# EAGLE design RFSWITCH_v2 (EAGLE 7.1.0)
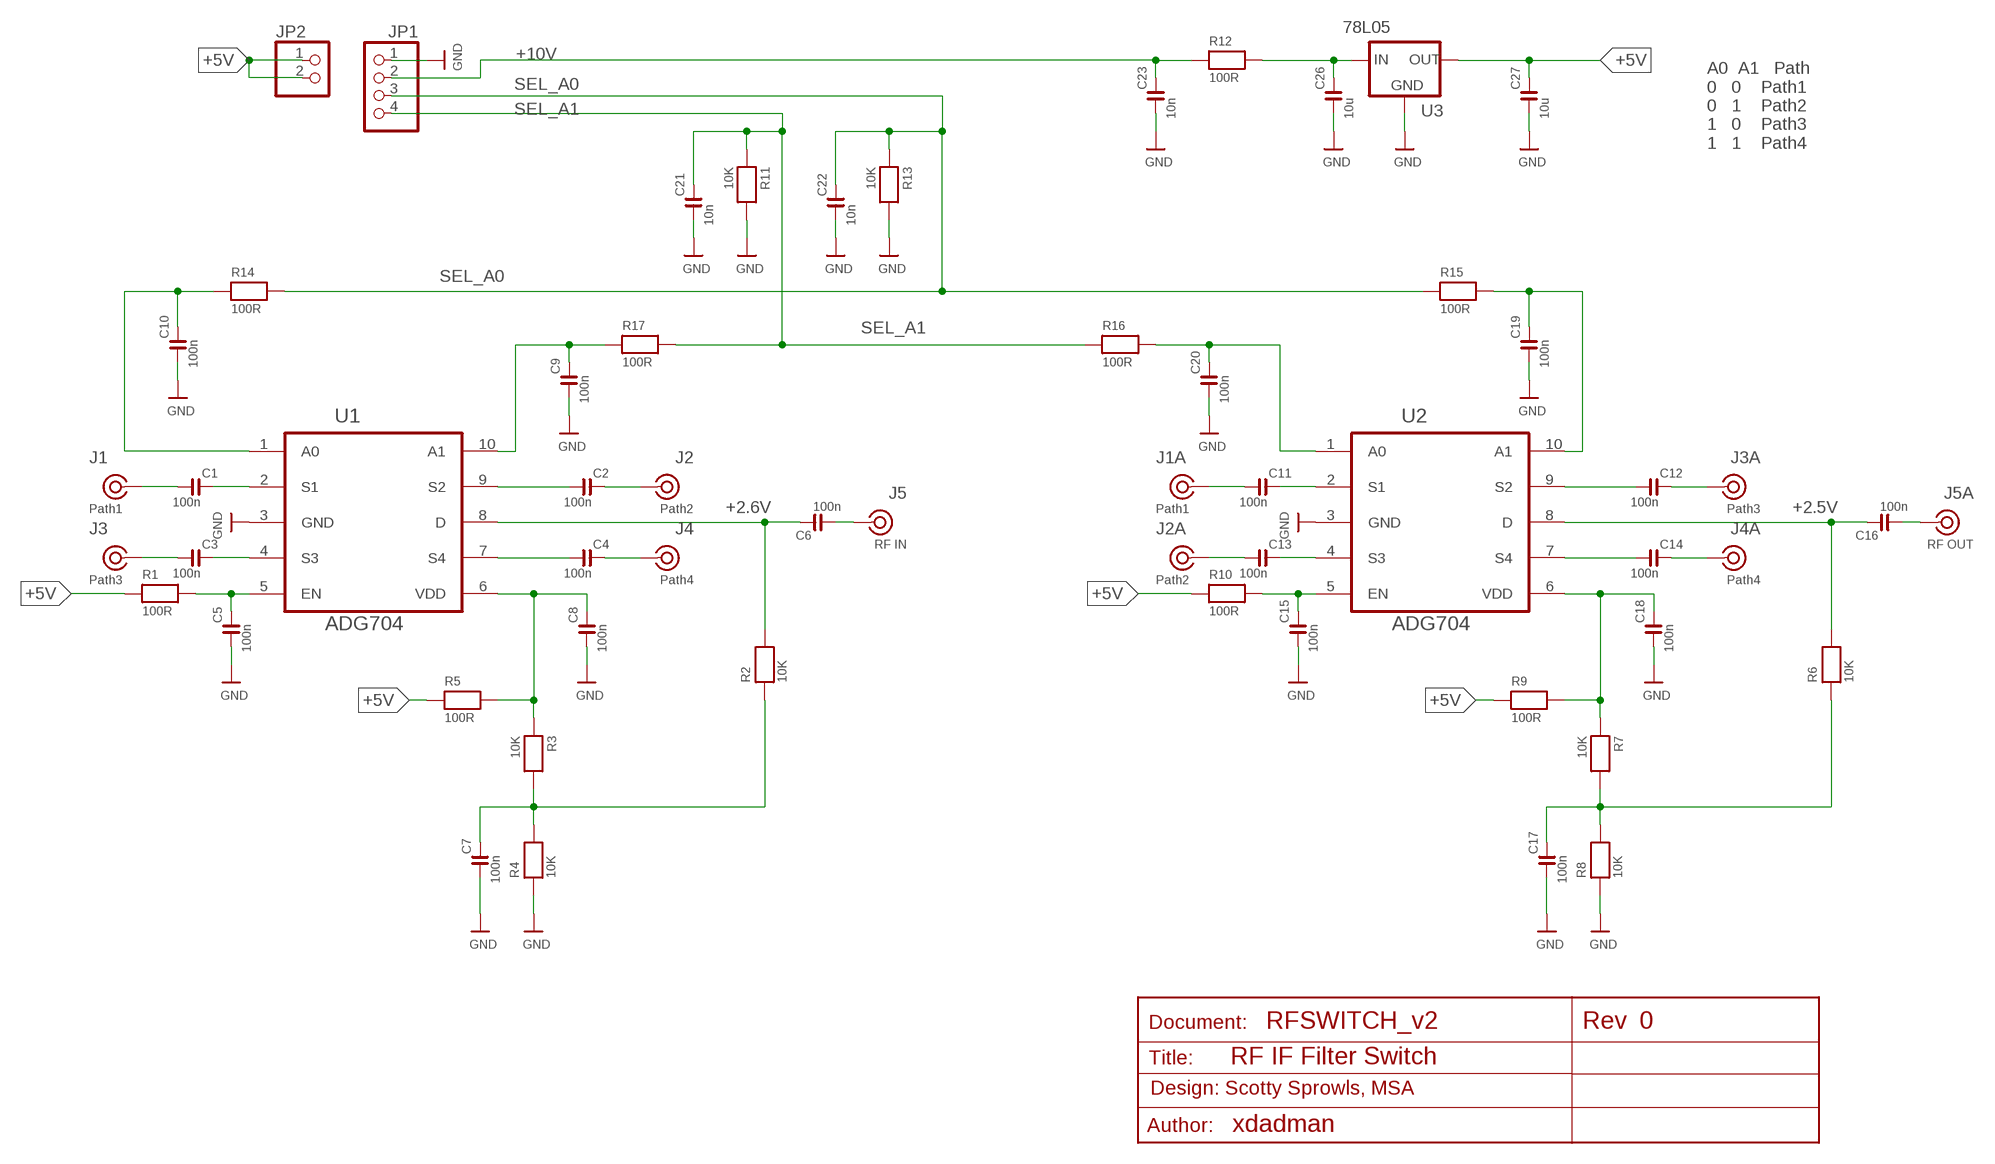
[diagram p0: schematic, sheet 1]

## Parts
C1  100n  C0805100N  [C0805]
C2  100n  C0805100N  [C0805]
C3  100n  C0805100N  [C0805]
C4  100n  C0805100N  [C0805]
C5  100n  CC0603100NF  [C0603]
C6  100n  C0805100N  [C0805]
C7  100n  C0805100N  [C0805]
C8  100n  CC0603100NF  [C0603]
C9  100n  C0805100N  [C0805]
C10  100n  C0805100N  [C0805]
C11  100n  C0805100N  [C0805]
C12  100n  C0805100N  [C0805]
C13  100n  C0805100N  [C0805]
C14  100n  C0805100N  [C0805]
C15  100n  CC0603100NF  [C0603]
C16  100n  C0805100N  [C0805]
C17  100n  C0805100N  [C0805]
C18  100n  CC0603100NF  [C0603]
C19  100n  C0805100N  [C0805]
C20  100n  C0805100N  [C0805]
C21  10n  C080510N  [C0805]
C22  10n  C080510N  [C0805]
C23  10n  C080510N  [C0805]
C26  10u  CC120610U  [C1206]
C27  10u  CC120610U  [C1206]
J1  Path1  COAX  [SLIM_COAX_PAD]
J1A  Path1  COAX  [SLIM_COAX_PAD]
J2  Path2  COAX  [SLIM_COAX_PAD]
J2A  Path2  COAX  [SLIM_COAX_PAD]
J3  Path3  COAX  [SLIM_COAX_PAD]
J3A  Path3  COAX  [SLIM_COAX_PAD]
J4  Path4  COAX  [SLIM_COAX_PAD]
J4A  Path4  COAX  [SLIM_COAX_PAD]
J5  RF IN  COAX  [SLIM_COAX_PAD]
J5A  RF OUT  COAX  [SLIM_COAX_PAD]
JP1  PINHD-1X4  [1X04]
JP2  PINHD-1X2  [1X02]
R1  100R  R0805100R  [C0805]
R2  10K  R080510K  [R0805]
R3  10K  R080510K  [R0805]
R4  10K  R080510K  [R0805]
R5  100R  R0805100R  [C0805]
R6  10K  R080510K  [R0805]
R7  10K  R080510K  [R0805]
R8  10K  R080510K  [R0805]
R9  100R  R0805100R  [C0805]
R10  100R  R0805100R  [C0805]
R11  10K  R080510K  [R0805]
R12  100R  R0805100R  [C0805]
R13  10K  R080510K  [R0805]
R14  100R  R0805100R  [C0805]
R15  100R  R0805100R  [C0805]
R16  100R  R0805100R  [C0805]
R17  100R  R0805100R  [C0805]
U1  ADG704  ADG704BRMZ  [SOP50P490X110-10N-ADG704]
U2  ADG704  ADG704BRMZ  [SOP50P490X110-10N-ADG704]
U3  78L05  78MXXL78L05  [SOT89]

## Nets
+5V: C27.2 JP2.1 JP2.2 R1.1 R5.1 R9.1 R10.1 U3.1(OUT)
+10V: C23.2 JP1.2 R12.1
GND: C5.1 C7.1 C8.1 C9.1 C10.1 C15.1 C17.1 C18.1 C19.1 C20.1 C21.1 C22.1 C23.1 C26.1 C27.1 JP1.1 R4.1 R8.1 R11.2 R13.2 U1.3(GND) U2.3(GND) U3.2(GND) U3.4(GND)
IN [50OHM_1mm]: C6.2 R2.2 U1.8(D)
IN1 [50OHM_1mm]: C16.2 R6.2 U2.8(D)
N$1 [50OHM_1mm]: C1.2 U1.2(S1)
N$2: C1.1 J1.SIG
N$3 [50OHM_1mm]: C3.2 U1.4(S3)
N$4 [50OHM_1mm]: C4.1 U1.7(S4)
N$5 [50OHM_1mm]: C2.1 U1.9(S2)
N$6: C2.2 J2.SIG
N$7: C4.2 J4.SIG
N$8: C3.1 J3.SIG
N$10 [50OHM_1mm]: C6.1 J5.SIG
N$11: C8.2 R3.1 R5.2 U1.6(VDD)
N$12: C7.2 R2.1 R3.2 R4.2
N$14 [50OHM_1mm]: C11.2 U2.2(S1)
N$15: C11.1 J1A.SIG
N$16 [50OHM_1mm]: C13.2 U2.4(S3)
N$17 [50OHM_1mm]: C14.1 U2.7(S4)
N$18 [50OHM_1mm]: C12.1 U2.9(S2)
N$19: C12.2 J3A.SIG
N$20: C14.2 J4A.SIG
N$21: C13.1 J2A.SIG
N$22: C16.1 J5A.SIG
N$23: C17.2 R6.1 R7.2 R8.2
N$24: C18.2 R7.1 R9.2 U2.6(VDD)
N$25: C15.2 R10.2 U2.5(EN)
N$26: C5.2 R1.2 U1.5(EN)
N$27: C26.2 R12.2 U3.3(IN)
N$28: C10.2 R14.1 U1.1(A0)
N$29: C9.2 R17.1 U1.10(A1)
N$30: C20.2 R16.2 U2.1(A0)
N$31: C19.2 R15.2 U2.10(A1)
SEL_A0: C22.2 JP1.3 R13.1 R14.2 R15.1
SEL_A1: C21.2 JP1.4 R11.1 R16.1 R17.2

## Notes on the sheet
- A0  A1   Path
  0   0    Path1
  0   1    Path2
  1   0    Path3
  1   1    Path4
- +2.6V | +2.5V
- 0
- RF IF Filter Switch
- Design: Scotty Sprowls, MSA
- xdadman

## Power pins joined to a net without a drawn wire
GND: J1.GND J1A.GND J2.GND J2A.GND J3.GND J3A.GND J4.GND J4A.GND J5.GND J5A.GND

## Library data of the parts
C1-C4 C6 C7 C9-C14 C16 C17 C19 C20 = MSA_lib:C0805: Ceramic capacitor; OC_FARNELL: 1759166
C5 C8 C15 C18 = MSA_lib:CC0603: 0603 Ceramic capacitor; OC_FARNELL: 1759016
C21-C23 = MSA_lib:C0805: Ceramic capacitor; OC_FARNELL: 1414662
C26 C27 = MSA_lib:CC1206: Capacitor ceramic 1206; OC_FARNELL: 1611967
J1 J1A J2 J2A J3 J3A J4 J4A J5 J5A = MSA_lib:COAX
JP1 = MSA_lib:PINHD-1X4: PIN HEADER
JP2 = MSA_lib:PINHD-1X2: PIN HEADER
R1 R5 R9 R10 R12 R14-R17 = MSA_lib:R0805: Resistors; OC_FARNELL: 2008370
R2-R4 R6-R8 R11 R13 = MSA_lib:R0805: Resistors; OC_FARNELL: 2073607
U1 U2 = MSA_lib:ADG704BRMZ: CMOS Low Voltage 4 V, 4-Channel Multiplexer; MPN: ADG704BRMZ; OC_FARNELL: 9425756; OC_NEWARK: 59K1493; PACKAGE: SOP-10; SUPPLIER: Analog Devices
U3 = MSA_lib:78MXXL: VOLTAGE REGULATOR; OC_FARNELL: 1366573

## Net classes
1 50OHM_1mm: clearance 0.201 mm

## Board

Size 64 x 32 mm. Coordinates in mm from the lower left corner, seen from the top.
Outline: 0,0 64,0 64,32 0,32 0,0
Copper layers (1*16): Top 0.035mm / dielectric 1.5mm / Bottom 0.035mm
Design rules "kuba_no_CLR": minimum track width 8mil, minimum drill 15mil, track to track 8mil, track to pad 8mil, pad to pad 8mil, via to via 8mil, smd to smd 8mil, copper to edge 0mil, drill to drill 8mil, minimum pad ring 12mil, minimum via ring 10mil, stop-mask expansion 4mil, vias tented up to drill 0mil, thermal gap 10mil

### Footprints (pad centres in the part's own frame; a part is rotated, then mirrored left to right if it is on the bottom)
C0805 = smd 1.2 x 1.5: 1 -0.953,0; 2 0.953,0
C0603 = smd 0.9 x 1.1: 1 -0.794,0; 2 0.794,0
C1206 = smd 1.6 x 1.8: 1 -1.4,0; 2 1.4,0
SLIM_COAX_PAD = smd 1.27 x 0.635 bottom: GND 0,-2.667 | drill 1.1: SIG 0,0
1X04 = drill 1.016: 1 -3.81,0; 2 -1.27,0; 3 1.27,0; 4 3.81,0
1X02 = drill 1.016: 1 -1.27,0; 2 1.27,0
R0805 = smd 1.3 x 1.5: 1 -0.95,0; 2 0.95,0
SOP50P490X110-10N-ADG704 = smd 1.118 x 0.305: 1 -2.134,1.016; 2 -2.134,0.508; 3 -2.134,0; 4 -2.134,-0.508; 5 -2.134,-1.016; 6 2.134,-1.016; 7 2.134,-0.508; 8 2.134,0; 9 2.134,0.508; 10 2.134,1.016
SOT89 = smd 1.2 x 1.5: 1 -1.6,-2; 3 1.6,-2 | smd 1 x 1.5: 2 0,-2 | smd 2.4 x 3: 4 0,1.25

### Placement (x,y rotation side)
C1  20.19,23.62 270 top
C2  20.32,8.26 270 top
C3  12.83,23.75 270 top
C4  12.7,8.26 270 top
C5  12.19,19.56 0 top
C6  9.4,16 0 top
C7  9.27,20.07 270 top
C8  12.45,13.84 0 top
C9  19.81,14.99 180 top
C10  19.81,16.76 180 top
C11  40.25,9.04 0 top
C12  41.26,24.37 180 top
C13  52.08,9 180 top
C14  51.92,24.37 0 top
C15  50.91,13.45 180 top
C16  55.62,16.15 180 top
C17  54.1,19.81 0 top
C18  50.15,18.79 180 top
C19  42.42,17.78 90 top
C20  42.42,14.73 270 top
C21  39.62,16 180 top
C22  35.81,18.8 270 top
C23  29.46,17.78 0 top
C26  29.56,23.17 0 top
C27  29.41,26.76 90 top
J1  23.37,25.65 270 top
J1A  38.85,6.5 270 top
J2  23.37,6.35 90 top
J2A  53.84,6.5 270 top
J3  9.65,25.65 270 top
J3A  39.36,25.55 90 top
J4  9.65,6.35 0 top
J4A  53.58,25.55 90 top
J5  7.11,16 270 top
J5A  57.65,16.15 90 top
JP1  32.51,15.24 0 top
JP2  46.48,27.43 0 top
R1  6.35,25.4 270 top
R2  11.68,17.02 270 top
R3  5.08,19.05 0 top
R4  7.37,20.07 270 top
R5  4.57,25.4 270 top
R6  53.23,17.03 270 top
R7  57,22.6 270 top
R8  57.91,19.81 180 top
R9  57.92,26.27 270 top
R10  59.7,26.27 270 top
R11  39.62,14.22 0 top
R12  32.26,18.8 90 top
R13  34.04,18.8 90 top
R14  31.5,12.7 0 top
R15  39.62,17.78 0 top
R16  39.12,11.68 0 top
R17  35.56,11.68 0 top
U1  16.26,16 270 top
U2  46.34,16.25 90 top
U3  34.45,26.87 270 top

### Tracks (layer width: path | path; a pad name or v marks a point on that pad's centre or on a via)
+5V
  Top 0.254: U3.1 32.45,28.13 | 29.71,28.47 C27.2
  Top 0.406: R5.1 R1.1 4.38,26.35 4.32,26.42 4.32,28.45 4.83,28.96 28.62,28.96 C27.2 | 32.45,28.13 33.27,28.96 45.21,28.96 | 45.21,28.96 47.75,28.96 | 47.75,28.96 57.4,28.96 57.91,28.45 57.91,27.23 R9.1 R10.1 | JP2.1 45.21,28.96 | JP2.2 47.75,28.96
  Top 0.61: 29.71,28.47 U3.1
+10V
  Top 0.406: R12.1 32.19,17.78 C23.2 30.48,17.72 30.48,16.76 31.24,16 JP1.2
GND  (via drill 0.4, 0.5, 0.6)
  Top 0.254: 46.34,7.77 U2.3 46.34,15.39 v46.23,15.49 | U3.2 U3.4 | R13.2 C22.1 | 16.26,22.35 U1.3 v16.26,16.76 | C8.1 11.18,13.84 v11.18,13.72 | C18.1 51.55,18.79 v51.56,18.8
  Top 0.305: C9.1 C10.1 20.77,15.81 v20.83,15.75
  Top 0.406: 8.13,21.02 C7.1 9.34,21.02 9.4,21.08 | R4.1 9.84,21.02 v10.16,20.95 | C17.1 | R8.1 58.86,20.51 v58.93,20.57 | v52.31,19.8 v52.32,19.81 | R11.2 C21.1 42.1,16 C20.1 v42.42,16 C19.1 | C23.1 28.51,15.43 JP1.1 | C15.1 v52.31,13.45 v52.32,13.46 | R13.2 34,19.75 34,20 34.29,20 v34.29,20.32
  Top 0.61: U3.2 32.25,26.67 30.48,26.67 29.41,25.6 C27.1 28.16,24.11 C26.1 | 28.16,18.13 C23.1
  Bottom 0.254: v34.29,20.32 34.29,19.81 | v11.18,13.72 11.18,13.97 | v16.26,16.76 16.26,17.02 | v46.23,15.49 46.48,15.49 | v51.56,18.8 51.31,18.8
  Bottom 0.305: v20.83,15.75 20.83,16
  Bottom 0.406: 9.91,21.34 v10.16,20.95 9.4,21.08 | v58.93,20.57 58.93,20.32 | v52.32,19.81 52.07,19.81 | v42.42,16 42.42,15.75 | v52.32,13.46 52.07,13.46 | 34.29,19.81 34.04,19.81 R13.2
  other vias: 16.26,11.68 15.75,10.92 15.24,10.16 14.73,9.4 14.22,8.64 14.22,7.62 14.22,6.6 13.72,5.84 12.7,5.84 11.94,5.08 13.97,12.45 13.21,11.68 12.7,10.92 11.18,9.65 11.18,8.64 9.65,8.89 8.51,8.64 7.62,8 7.11,7.11 10.16,3.81 11.18,4.32 16.76,11.18 17.27,10.67 17.78,9.91 18.16,9.4 18.67,8.89 18.8,8.26 18.8,7.49 18.8,6.6 19.18,5.84 20.07,5.84 20.95,5.46 18.16,13.21 18.8,12.45 19.43,11.68 19.94,11.05 20.57,10.54 21.84,9.78 21.84,9.02 21.84,8.38 22.73,8.89 24,8.76 21.59,4.45 22.61,3.94 23.75,3.81 24.77,4.19 17.4,15.11 16.89,16.51 14.73,14.99 14.1,17.27 13.21,17.27 13.21,17.91 10.41,14.48 9.65,14.48 8.76,14.1 7.87,13.59 6.86,13.46 5.59,13.84 4.83,14.73 4.83,17.27 8.89,17.78 18.16,18.67 18.67,19.3 19.18,19.81 19.68,20.45 20.19,20.95 20.7,21.34 16.26,20.19 16.76,20.7 17.27,21.21 17.78,21.84 18.29,22.35 15.88,20.7 15.37,21.34 14.86,22.1 18.67,24.77 14.35,22.86 14.35,23.75 18.67,22.99 18.67,23.75 14.35,24.51 14.35,25.53 13.34,26.16 12.19,26.16 11.81,27.18 10.92,27.94 11.3,23.75 11.3,22.61 14.22,19.18 10.16,23.11 8.89,23.24 7.62,27.56 8.64,28.07 12.32,21.46 18.92,25.78 20.45,26.04 21.08,26.92 22.1,27.94 25.15,27.56 25.91,26.67 26.04,25.27 25.53,24 24.51,23.24 23.24,22.99 21.72,23.62 21.72,22.48 7.87,23.75 25.53,4.95 26.04,6.22 25.78,7.49 25.15,8.38 8.89,3.81 7.87,4.32 7.24,5.08 6.99,6.1 46.35,20.7 45.85,21.34 45.47,21.97 45.09,22.61 44.58,23.11 44.2,23.75 43.69,24.38 43.56,25.27 42.93,25.91 42.04,25.91 44.45,19.3 43.94,19.94 43.43,20.57 42.93,21.21 42.42,21.84 42.04,22.48 41.53,22.86 40.64,22.86 39.75,22.86 38.86,22.99 46.86,21.34 47.37,21.97 47.75,22.61 48.26,23.24 48.64,23.88 49.15,24.51 49.66,25.27 50.67,25.91 48.13,19.43 49.91,21.72 50.55,22.35 50.93,22.86 51.56,22.86 52.2,22.86 53.09,22.86 53.98,22.99 54.86,23.37 51.44,27.05 52.58,27.81 54.23,28.07 55.5,27.43 56.13,26.16 55.5,24 41.53,26.8 40.77,27.69 39.37,27.94 38.1,27.81 36.96,24.64 37.59,23.62 36.58,27.56 36.58,26.42 33.53,26.8 48.64,17.4 51.69,17.4 51.05,17.4 50.16,17.4 49.4,17.4 48.64,15.11 49.28,15.11 50.04,15.11 50.8,15.11 51.56,15.11 52.96,14.61 53.59,14.61 54.36,14.61 55.24,14.61 56.26,13.97 57.53,13.59 58.93,13.84 59.44,14.35 59.44,18.03 54.74,17.65 55.5,17.78 56.26,18.29 44.07,17.4 44.07,15.24 44.2,13.21 43.69,12.7 43.05,12.19 42.55,11.68 41.91,11.18 37.97,10.16 46.23,12.06 37.72,9.02 36.83,8.13 36.32,6.1 36.96,4.7 38.86,3.94 40.51,4.57 41.53,6.35 41.4,7.49 42.29,7.49 42.55,8.64 43.18,9.14 43.81,9.65 44.32,10.16 44.96,10.67 49.78,7.87 45.59,11.3 46.74,11.56 47.24,11.05 47.75,10.54 48.26,10.03 48.77,9.53 49.53,8.89 50.67,7.49 51.56,7.49 51.18,6.22 51.69,4.83 53.59,3.81 55.5,4.32 56.39,5.97 56.13,8.13 54.48,9.14 54.1,10.54 52.7,10.54 51.31,10.54 50.55,11.18 48.26,13.21 59.82,4.19 49.66,11.94 48.9,12.7 48.9,20.19 49.4,20.95 29.21,25.53 28.19,23.11 28.32,20.19 30.23,20.19 37.08,19.81 32.77,23.5 28.32,3.94 28.32,10.03 28.57,13.08 59.82,10.79 60.07,28.83 46.48,25.65 46.1,4.19 16.64,3.68 16.64,27.81 3.94,4.19 27.81,17.65 10.79,19.68
  pour Bottom: 0,0 64.08,0 64,32 0,32
  pour Top: 0.25,0 64.01,0 64.01,32 0,32 0,0
IN
  Top 0.254: U1.8 16.26,15.24
  Top 0.813: C6.2 11.62,16 R2.2 15.43,16.07 16,15.49 16.26,15.24
IN1
  Top 0.254: U2.8 46.34,16.91
  Top 0.813: 46.34,16.91 46.99,16.26 53.05,16.26 R6.2 54.59,16.08 C16.2
N$1
  Top 0.254: U1.2 16.76,19.05 17.02,19.3
  Top 0.813: 17.02,19.3 C1.2
N$2
  Top 0.813: C1.1 J1.SIG
N$3
  Top 0.254: U1.4 15.75,19.05 15.49,19.3
  Top 0.406: 13.08,22.48 13.08,22.54 C3.2
  Top 0.813: 15.49,19.3 13.08,22.48 | 12.83,22.73 C3.2
N$4
  Top 0.254: U1.7 15.75,13.08 15.49,12.7
  Top 0.813: 15.49,12.7 13.21,9.4 C4.1
N$5
  Top 0.254: U1.9 16.76,13.08 17.02,12.7
  Top 0.813: 17.02,12.7 19.81,9.4 C2.1
N$6
  Top 0.813: C2.2 J2.SIG
N$7
  Top 0.813: C4.2 J4.SIG
N$8
  Top 0.813: C3.1 J3.SIG
N$9
  cutout Top: 28.7,22.35 28.7,28.7 33.02,28.7 33.02,22.35
N$10
  Top 0.813: J5.SIG C6.1
N$11
  Top 0.254: U1.6 13.65,13.87 13.42,13.87 13.4,13.84 C8.2
  Top 0.406: 13.65,13.87 13.65,13.4 12.7,12.45 4.32,12.45 3.81,12.95 3.81,18.73 R3.1 4.38,19.3 4.38,19.37 4.83,19.81 4.83,24.19 R5.2 4.38,24.38
N$12
  Top 0.406: R3.2 7.62,19.05 | 7.62,19.05 8.06,19.05 8.13,19.11 C7.2 9.84,18.54 10.92,18.54 11.5,17.97 R2.1 | R4.2 7.55,19.12 7.62,19.05
N$13
  cutout Top: 29.72,11.43 33.53,11.43 33.53,10.92 40.64,10.92 43.69,13.97 43.69,19.56 41.4,19.56 41.4,18.8 36.83,18.8 36.83,20.83 31.24,20.83 31.24,18.8 29.21,18.8 29.72,18.8
N$14
  Top 0.254: U2.2 45.83,13.19 45.47,12.83
  Top 0.813: 45.47,12.83 C11.2
N$15
  Top 0.813: C11.1 J1A.SIG
N$16
  Top 0.254: U2.4 46.84,13.1 47.12,12.83
  Top 0.813: 47.12,12.83 C13.2
N$17
  Top 0.254: U2.7 46.84,19.54 46.99,19.68
  Top 0.406: 50.55,24.38 50.96,24.38 C14.1
  Top 0.813: 46.99,19.68 50.55,24.38
N$18
  Top 0.254: U2.9 45.83,19.2 45.59,19.68
  Top 0.813: 45.59,19.68 C12.1
N$19
  Top 0.813: J3A.SIG C12.2
N$20
  Top 0.813: J4A.SIG C14.2
N$21
  Top 0.813: C13.1 J2A.SIG
N$22
  Top 0.813: C16.1 J5A.SIG
N$23
  Top 0.254: R7.2 57,20.52 R8.2
  Top 0.406: R6.1 53.54,17.98 54.61,19.05 54.61,19.37 C17.2 R8.2
N$24
  Top 0.254: U2.6 48.95,18.38 C18.2
  Top 0.406: R9.2 57.92,24.46 R7.1 56.83,23.37 56.39,23.37 55.63,22.61 55.63,21.59 55.12,21.08 51.05,21.08 49.78,19.81 49.78,19.22 C18.2
N$25
  Top 0.254: 60.2,24.82 R10.2 | U2.5 49.45,14.11 C15.2
  Top 0.406: R10.2 60.45,24.57 60.45,12.7 59.94,12.19 51.37,12.19 C15.2
N$26
  Top 0.254: U1.5 14.12,18.14 12.99,19.27 C5.2
  Top 0.406: R1.2 6.35,22.61 6.86,22.1 10.41,22.1 11.94,20.57 12.19,20.57 12.7,20.07 12.7,19.84 C5.2
N$27
  Top 0.254: 31.24,23.45 C26.2
  Top 0.61: 31.24,23.45 31.24,24.38 32,25.15 32.33,25.15 U3.3 | C26.2 30.96,23.14 32,22.1 32,20 R12.2
N$28
  Top 0.254: 17.27,17.78 17.84,17.78 C10.2
  Top 0.305: U1.1 17.27,17.78 | C10.2 18.86,17.08 19.81,18.03 21.59,18.03 22.1,17.53 22.1,14.48 24.64,11.94 29.78,11.94 R14.1
N$29
  Top 0.254: 17.27,14.22 18.1,14.22 C9.2
  Top 0.305: U1.10 17.27,14.22 | 18.61,14.73 C9.2 18.86,14.67 19.81,13.72 22.1,13.72 24.38,11.43 34.35,11.43 R17.1
N$30
  Top 0.254: U2.1 42.75,14.11 C20.2
  Top 0.406: R16.2 40.07,12.13 40.64,12.7 41.4,12.7 41.91,13.21 41.91,13.27 C20.2
N$31
  Top 0.254: U2.10 42.77,18.38 C19.2
  Top 0.406: R15.2 41.15,17.78 41.66,18.29 41.97,18.29 C19.2
SEL_A0
  Top 0.254: JP1.3 33.78,17.59 R13.1 C22.2
  Top 0.305: JP1.3 33.78,14.03 R14.2
  Top 0.406: R15.1 35.88,17.78 C22.2
SEL_A1
  Top 0.406: JP1.4 36.83,15.24 37.85,14.22 R11.1 | C21.2 R11.1 | R11.1 38.16,13.71 R16.1 R17.2

### Text on the board
tPlace: J3O | J4O | R5 | R1 | J3-I | J1-I | C27 | C3 | +5 | +5 | JP2 | C1 | U3 | R9 | R4 | C7 | R12 | R10 | C26 | R13 | C22 | C12 | C20 | C14 | C17 | R7 | R3 | C5 | C19 | C18 | C23 | R15 | R8 | R2 | C21 | C10 | C9 | R17 | R11 | R6 | J5-I | C6 | C8 | C15 | C16 | J5O | R14 | JP1 | R16 | U2 | U1 | G +10 A0 A1 | C4 | C2 | C11 | C13 | RF SWITCH | J1O | J2O | J4-I | J2-I